# EasyEDA schematic decaslime_mainboard_sch_easyeda.json
TITLE: motherboard; REV: 1.0; Date: 2022-06-12; Sheet: 1/1; Drawn By: artyknots; Company: Your Company
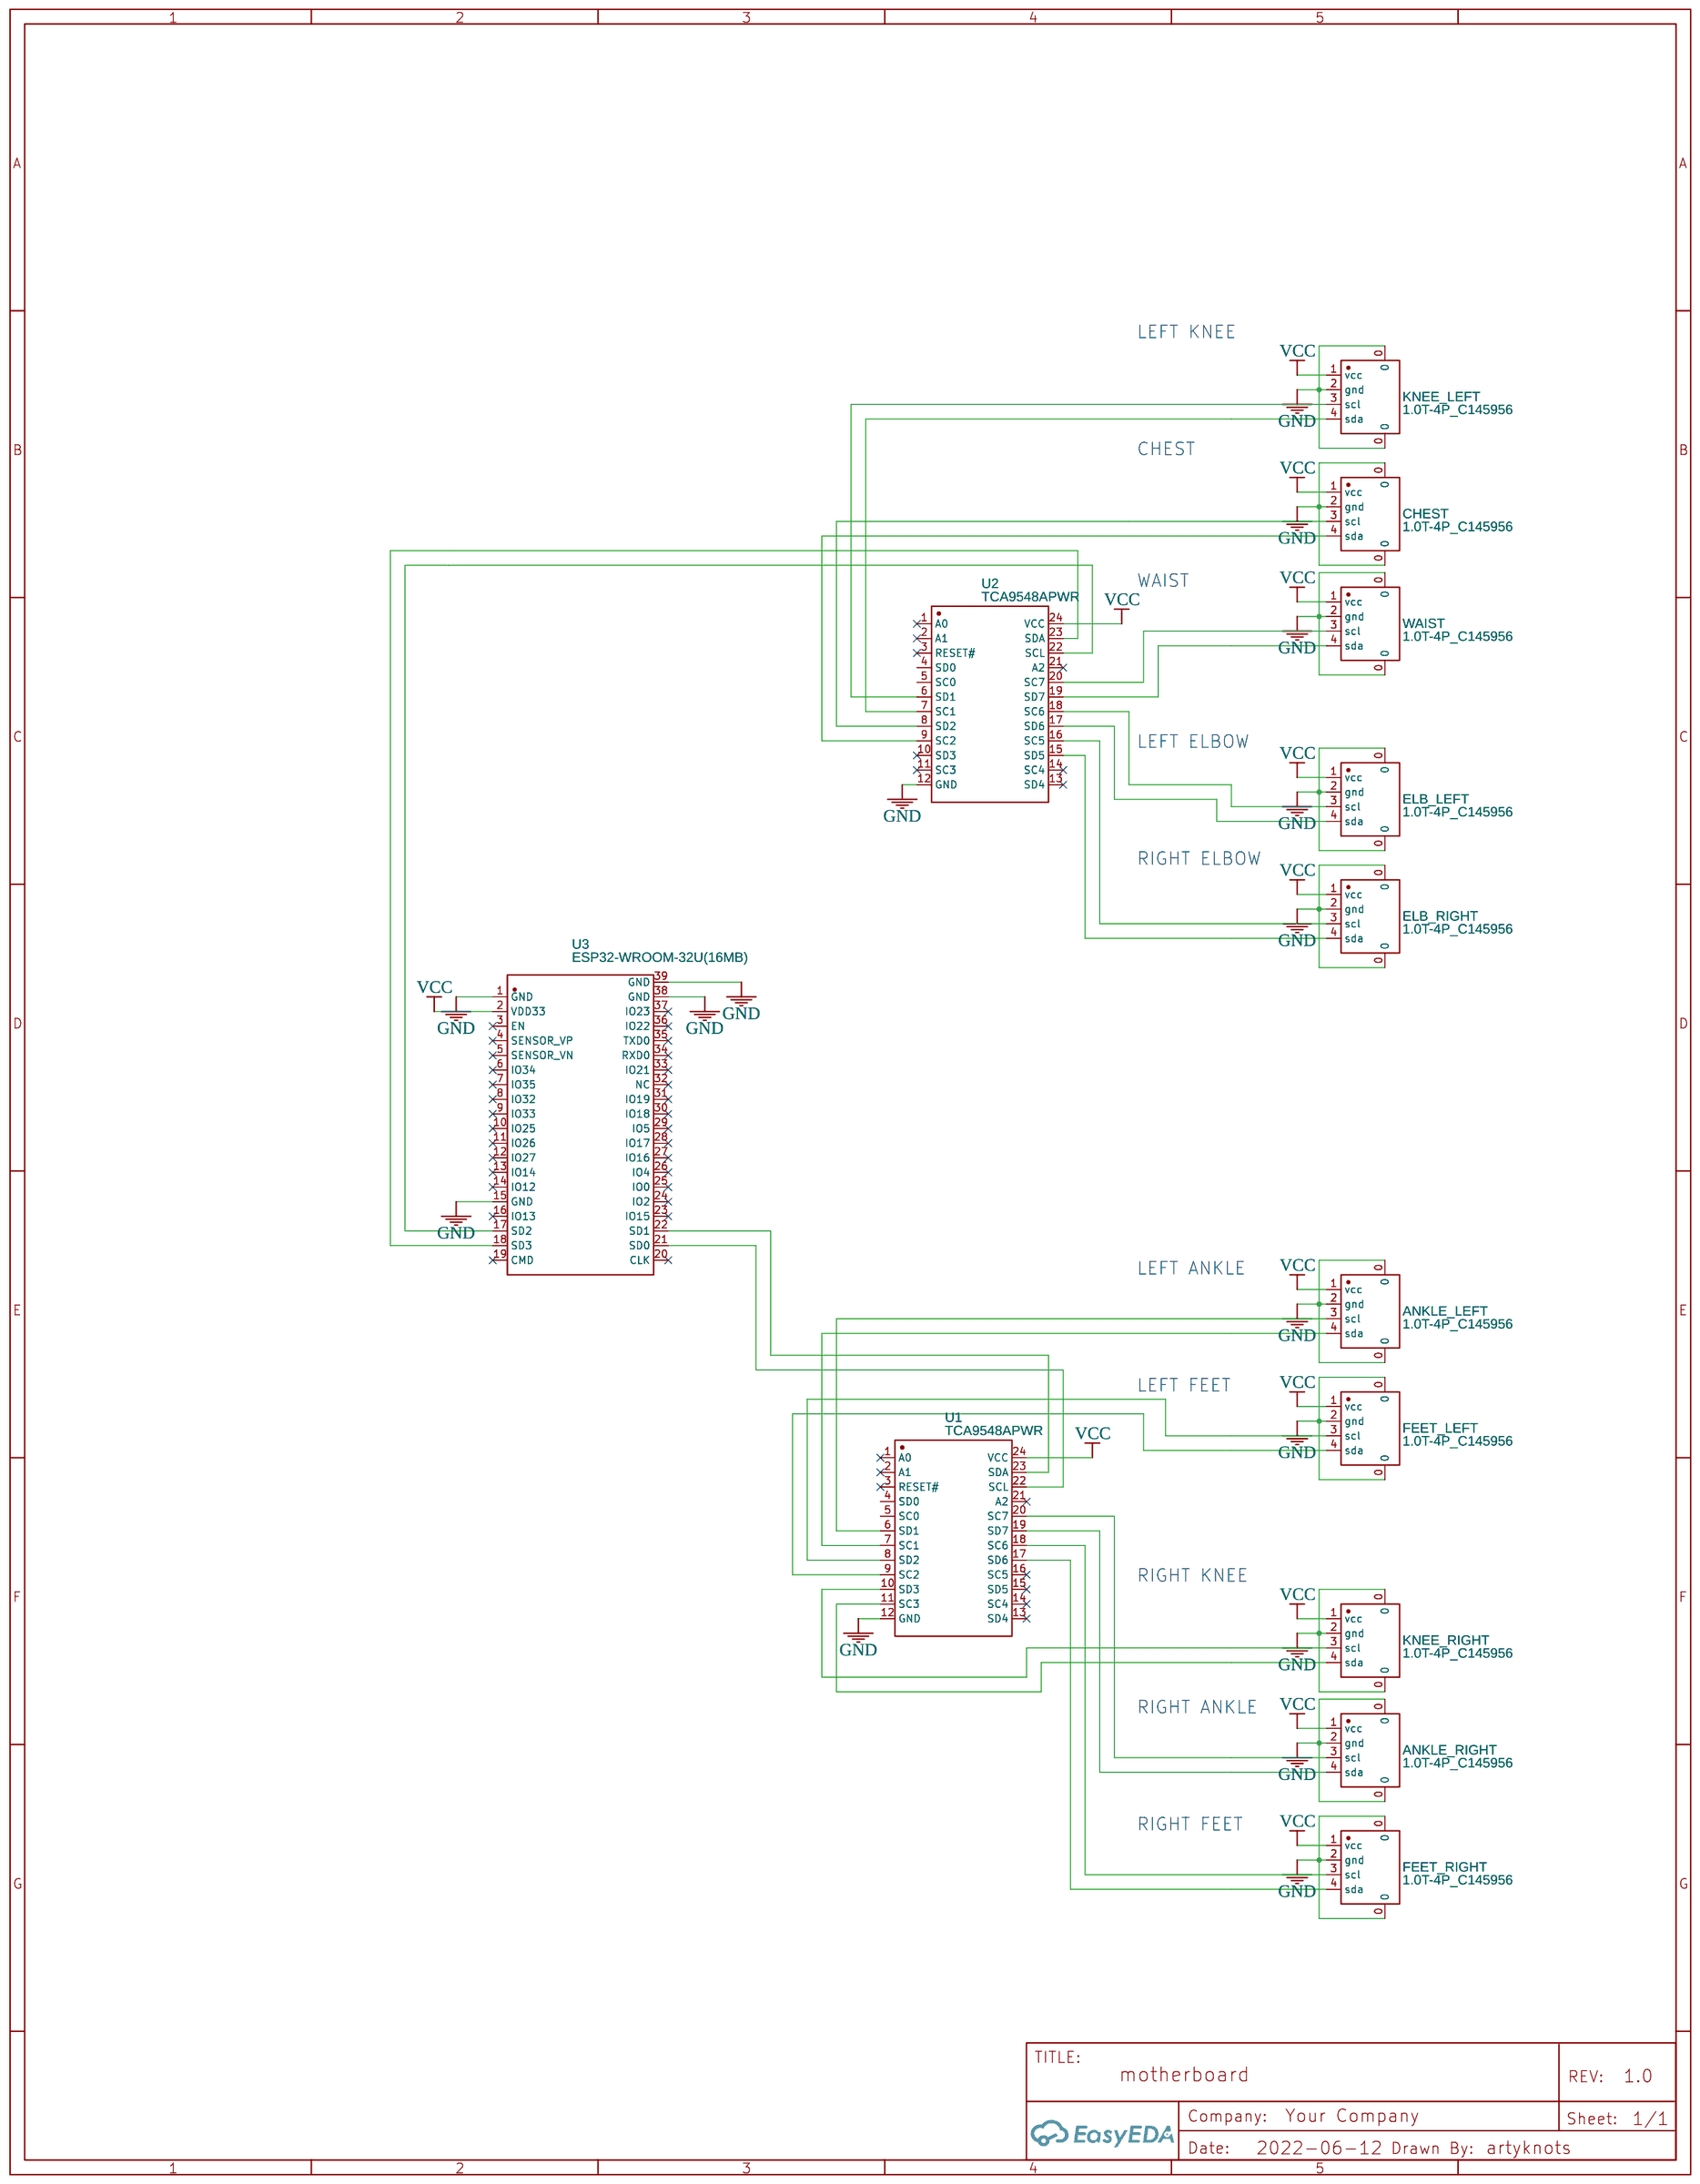
[diagram p0: schematic sheet]

## Parts
ANKLE_LEFT  1.0T-4P_C145956  [CONN-SMD_1.0T-4P]
ANKLE_RIGHT  1.0T-4P_C145956  [CONN-SMD_1.0T-4P]
CHEST  1.0T-4P_C145956  [CONN-SMD_1.0T-4P]
ELB_LEFT  1.0T-4P_C145956  [CONN-SMD_1.0T-4P]
ELB_RIGHT  1.0T-4P_C145956  [CONN-SMD_1.0T-4P]
FEET_LEFT  1.0T-4P_C145956  [CONN-SMD_1.0T-4P]
FEET_RIGHT  1.0T-4P_C145956  [CONN-SMD_1.0T-4P]
KNEE_LEFT  1.0T-4P_C145956  [CONN-SMD_1.0T-4P]
KNEE_RIGHT  1.0T-4P_C145956  [CONN-SMD_1.0T-4P]
U1  TCA9548APWR  [TSSOP-24_L7.8-W4.4-P0.65-LS6.4-BL]
U2  TCA9548APWR  [TSSOP-24_L7.8-W4.4-P0.65-LS6.4-BL]
U3  ESP32-WROOM-32U(16MB)  [WIFIM-SMD_39P-L19.2-W18.0-P1.27]
WAIST  1.0T-4P_C145956  [CONN-SMD_1.0T-4P]

## Library data of the parts
ANKLE_LEFT ANKLE_RIGHT CHEST ELB_LEFT ELB_RIGHT FEET_LEFT FEET_RIGHT KNEE_LEFT KNEE_RIGHT WAIST = 1.0T-4P_C145956: Supplier: LCSC; Supplier Part: C145956; Manufacturer: Boom Precision Elec; Contributor: 立创EDA官方封装库; JLCPCB Part Class: Extended Part
U1 U2 = TCA9548APWR: Supplier: LCSC; Manufacturer: TI; Supplier Part: C130026; JLCPCB Part Class: Extended Part
U3 = ESP32-WROOM-32U(16MB): Supplier: LCSC; Supplier Part: C529580; Manufacturer: Espressif Systems; Contributor: LCSC; JLCPCB Part Class: Extended Part

## Nets
GND: ANKLE_LEFT.0 ANKLE_LEFT.2(gnd) ANKLE_RIGHT.0 ANKLE_RIGHT.2(gnd) CHEST.0 CHEST.2(gnd) ELB_LEFT.0 ELB_LEFT.2(gnd) ELB_RIGHT.0 ELB_RIGHT.2(gnd) FEET_LEFT.0 FEET_LEFT.2(gnd) FEET_RIGHT.0 FEET_RIGHT.2(gnd) KNEE_LEFT.0 KNEE_LEFT.2(gnd) KNEE_RIGHT.0 KNEE_RIGHT.2(gnd) U1.12(GND) U2.12(GND) U3.1(GND) U3.15(GND) U3.38(GND) U3.39(GND) WAIST.0 WAIST.2(gnd)
VCC: ANKLE_LEFT.1(vcc) ANKLE_RIGHT.1(vcc) CHEST.1(vcc) ELB_LEFT.1(vcc) ELB_RIGHT.1(vcc) FEET_LEFT.1(vcc) FEET_RIGHT.1(vcc) KNEE_LEFT.1(vcc) KNEE_RIGHT.1(vcc) U1.24(VCC) U2.24(VCC) U3.2(VDD33) WAIST.1(vcc)
Net-(ANKLE_LEFT-3): ANKLE_LEFT.3(scl) U1.6(SD1)
Net-(ANKLE_LEFT-4): ANKLE_LEFT.4(sda) U1.7(SC1)
Net-(ANKLE_RIGHT-3): ANKLE_RIGHT.3(scl) U1.20(SC7)
Net-(ANKLE_RIGHT-4): ANKLE_RIGHT.4(sda) U1.19(SD7)
Net-(CHEST-3): CHEST.3(scl) U2.8(SD2)
Net-(CHEST-4): CHEST.4(sda) U2.9(SC2)
Net-(ELB_LEFT-3): ELB_LEFT.3(scl) U2.18(SC6)
Net-(ELB_LEFT-4): ELB_LEFT.4(sda) U2.17(SD6)
Net-(ELB_RIGHT-3): ELB_RIGHT.3(scl) U2.16(SC5)
Net-(ELB_RIGHT-4): ELB_RIGHT.4(sda) U2.15(SD5)
Net-(FEET_LEFT-3): FEET_LEFT.3(scl) U1.8(SD2)
Net-(FEET_LEFT-4): FEET_LEFT.4(sda) U1.9(SC2)
Net-(FEET_RIGHT-3): FEET_RIGHT.3(scl) U1.18(SC6)
Net-(FEET_RIGHT-4): FEET_RIGHT.4(sda) U1.17(SD6)
Net-(KNEE_LEFT-3): KNEE_LEFT.3(scl) U2.6(SD1)
Net-(KNEE_LEFT-4): KNEE_LEFT.4(sda) U2.7(SC1)
Net-(KNEE_RIGHT-3): KNEE_RIGHT.3(scl) U1.10(SD3)
Net-(KNEE_RIGHT-4): KNEE_RIGHT.4(sda) U1.11(SC3)
Net-(U1-22): U1.22(SCL) U3.21(SD0)
Net-(U1-23): U1.23(SDA) U3.22(SD1)
Net-(U2-19): U2.19(SD7) WAIST.4(sda)
Net-(U2-20): U2.20(SC7) WAIST.3(scl)
Net-(U2-22): U2.22(SCL) U3.17(SD2)
Net-(U2-23): U2.23(SDA) U3.18(SD3)

Not connected (* = marked no-connect by the designer): U1 1(A0)* 2(A1)* 3(RESET#)* 4(SD0) 5(SC0) 13(SD4)* 14(SC4)* 15(SD5)* 16(SC5)* 21(A2)*; U2 1(A0)* 2(A1)* 3(RESET#)* 4(SD0) 5(SC0) 10(SD3)* 11(SC3)* 13(SD4)* 14(SC4)* 21(A2)*; U3 3(EN)* 4(SENSOR_VP)* 5(SENSOR_VN)* 6(IO34)* 7(IO35)* 8(IO32)* 9(IO33)* 10(IO25)* 11(IO26)* 12(IO27)* 13(IO14)* 14(IO12)* 16(IO13)* 19(CMD)* 20(CLK)* 23(IO15)* 24(IO2)* 25(IO0)* 26(IO4)* 27(IO16)* 28(IO17)* 29(IO5)* 30(IO18)* 31(IO19)* 32(NC)* 33(IO21)* 34(RXD0)* 35(TXD0)* 36(IO22)* 37(IO23)*

## Notes on the sheet
- LEFT KNEE
- CHEST
- WAIST
- LEFT ELBOW
- RIGHT ELBOW
- LEFT ANKLE
- LEFT FEET
- RIGHT KNEE
- RIGHT ANKLE
- RIGHT FEET
